# EAGLE schematic 10w_CREE_LED_driver (EAGLE 6.2)
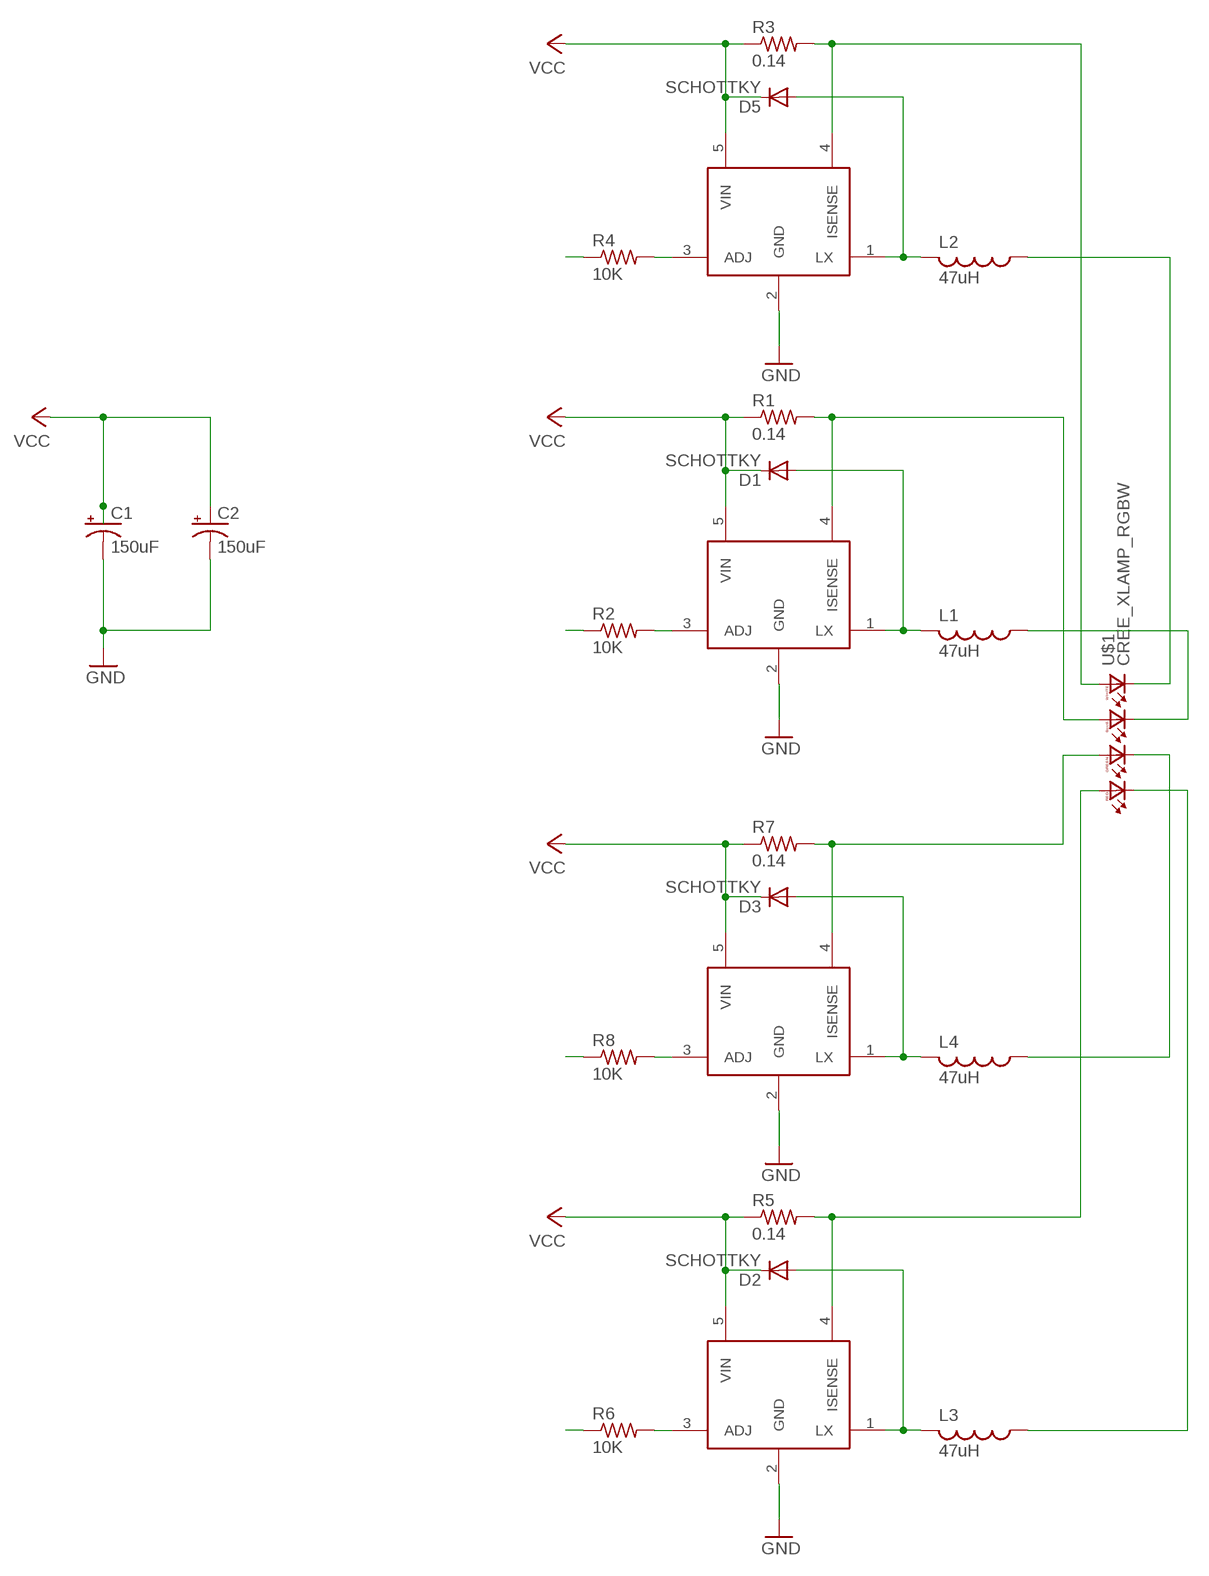
[diagram p0: schematic, sheet 1]

## Parts
C1  150uF  CPOL-US175TMP-0810  [175TMP-0810]
C2  150uF  CPOL-US175TMP-0810  [175TMP-0810]
D1  SCHOTTKY  DIODE-DO214AC  [DO214AC]
D2  SCHOTTKY  DIODE-DO214AC  [DO214AC]
D3  SCHOTTKY  DIODE-DO214AC  [DO214AC]
D5  SCHOTTKY  DIODE-DO214AC  [DO214AC]
L1  47uH  L-US  [TDK6045]
L2  47uH  L-US  [TDK6045]
L3  47uH  L-US  [TDK6045]
L4  47uH  L-US  [TDK6045]
R1  0.14  R-US_R0805  [R0805]
R2  10K  R-US_R0603  [R0603]
R3  0.14  R-US_R0805  [R0805]
R4  10K  R-US_R0603  [R0603]
R5  0.14  R-US_R0805  [R0805]
R6  10K  R-US_R0603  [R0603]
R7  0.14  R-US_R0805  [R0805]
R8  10K  R-US_R0603  [R0603]
U$1  CREE_XLAMP_RGBW  [CREE_XLAMP_XML]
U$2  ZLED7000-LEDDRIVER  [SOT89-5]
U$3  ZLED7000-LEDDRIVER  [SOT89-5]
U$4  ZLED7000-LEDDRIVER  [SOT89-5]
U$6  ZLED7000-LEDDRIVER  [SOT89-5]

## Nets
GND: C1.- C2.- U$2.2(GND) U$3.2(GND) U$4.2(GND) U$6.2(GND)
N$1: R2.2 U$2.3(ADJ)
N$2: R2.1
N$3: R1.2 U$1.3(BA) U$2.4(ISENSE)
N$4: L2.1 U$1.5(WC)
N$5: D1.A L1.2 U$2.1(LX)
N$6: R3.2 U$1.4(WA) U$6.4(ISENSE)
N$7: D5.A L2.2 U$6.1(LX)
N$8: R4.2 U$6.3(ADJ)
N$9: R4.1
N$10: R5.2 U$1.1(RA) U$3.4(ISENSE)
N$11: D2.A L3.2 U$3.1(LX)
N$12: R6.2 U$3.3(ADJ)
N$13: R6.1
N$14: R7.2 U$1.2(GA) U$4.4(ISENSE)
N$15: D3.A L4.2 U$4.1(LX)
N$16: R8.2 U$4.3(ADJ)
N$17: R8.1
N$18: L1.1 U$1.6(BC)
N$19: L4.1 U$1.7(GC)
N$20: L3.1 U$1.8(RC)
VCC: C1.+ C2.+ D1.C D2.C D3.C D5.C R1.1 R3.1 R5.1 R7.1 U$2.5(VIN) U$3.5(VIN) U$4.5(VIN) U$6.5(VIN)

## Library data of the parts
C1 C2 = adafruit:CPOL-US: POLARIZED CAPACITOR, American symbol
D1-D3 D5 = diode:DIODE-: DIODE
L1-L4 = rcl:L-US: INDUCTOR, American symbol
R1-R8 = adafruit:R-US_: RESISTOR, American symbol
U$1 = led:CREE_XLAMP_RGBW: Cree XLAMP XM-L Color RGBW led http://www.mouser.com/ds/2/90/XLampXML_Color-218132.pdf
U$2-U$4 U$6 = adafruit:ZLED7000-LEDDRIVER